# EAGLE design Mini AMplifier (EAGLE 7.6.0)
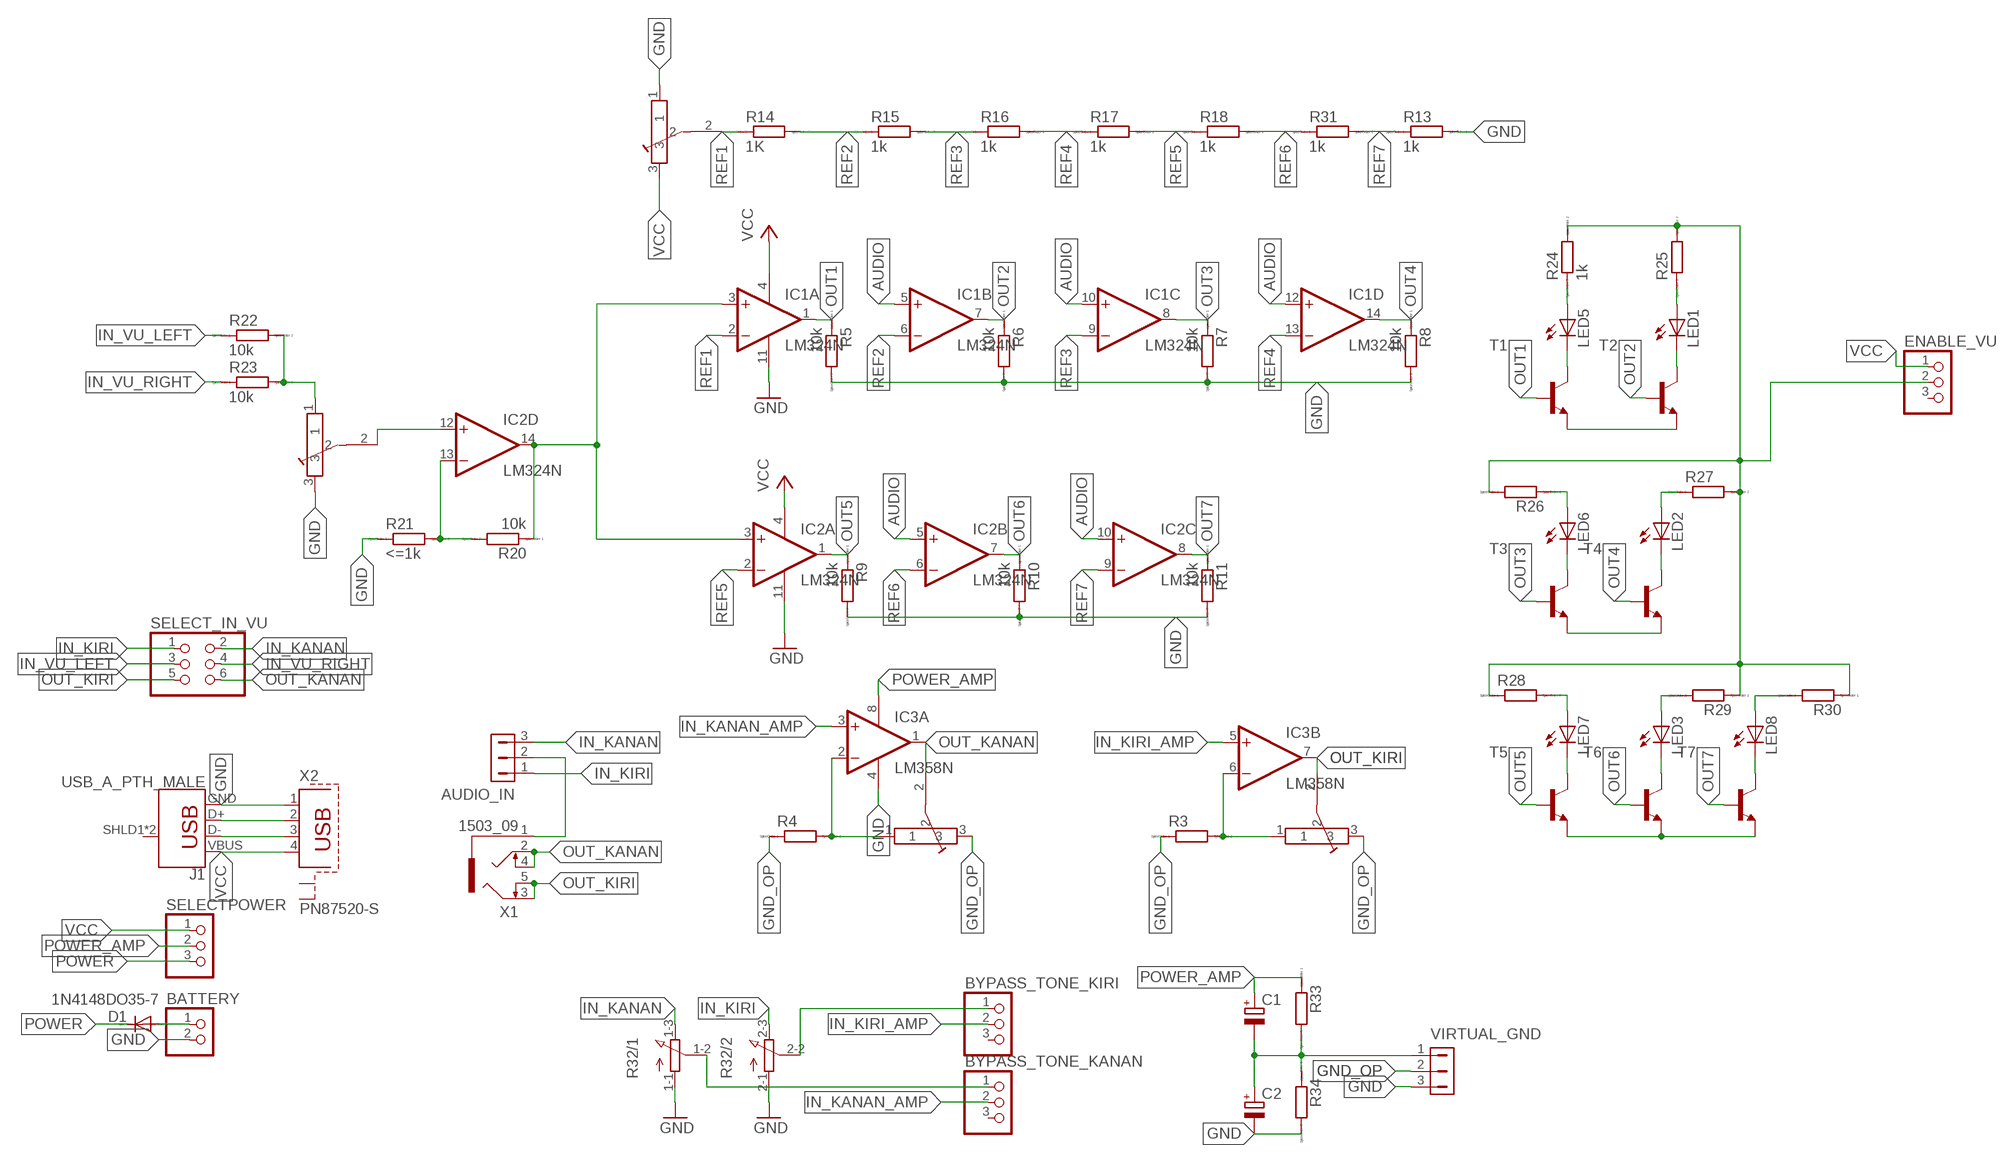
[diagram p0: schematic, sheet 1]

## Parts
AUDIO_IN  HDR-1X3  [SIP-100-3V]
BATTERY  PINHD-1X2  [1X02]
BYPASS_TONE_KANAN  PINHD-1X3  [1X03]
BYPASS_TONE_KIRI  PINHD-1X3  [1X03]
C1  CPOL-EUE2.5-6  [E2,5-6]
C2  CPOL-EUE2.5-6  [E2,5-6]
D1  1N4148DO35-7  [DO35-7]
ENABLE_VU  PINHD-1X3  [1X03]
IC1  LM324N  [DIL14]
IC2  LM324N  [DIL14]
IC3  LM358N  [DIL08]
J1  USB_A_PTH_MALE  [USB-A-H]
LED1  LED3MM  [LED3MM]
LED2  LED3MM  [LED3MM]
LED3  LED3MM  [LED3MM]
LED5  LED3MM  [LED3MM]
LED6  LED3MM  [LED3MM]
LED7  LED3MM  [LED3MM]
LED8  LED3MM  [LED3MM]
R3  R  [R0805]
R4  R  [R0805]
R5  10k  R0204/7  [0204/7]
R6  10k  R0204/7  [0204/7]
R7  10k  R0204/7  [0204/7]
R8  10k  R0204/7  [0204/7]
R9  10k  R0204/7  [0204/7]
R10  10k  R0204/7  [0204/7]
R11  10k  R0204/7  [0204/7]
R13  1k  R0204/7  [0204/7]
R14  1K  R0204/7  [0204/7]
R15  1k  R0204/7  [0204/7]
R16  1k  R0204/7  [0204/7]
R17  1k  R0204/7  [0204/7]
R18  1k  R0204/7  [0204/7]
R20  10k  R  [R0805]
R21  <=1k  R  [R0805]
R22  10k  R  [R0805]
R23  10k  R  [R0805]
R24  1k  R  [R0805]
R25  R  [R0805]
R26  R  [R0805]
R27  R  [R0805]
R28  R  [R0805]
R29  R  [R0805]
R30  R  [R0805]
R31  1k  R0204/7  [0204/7]
R32  3RP/1610G  [3RP/1610G]
R33  R0204/7  [0204/7]
R34  R0204/7  [0204/7]
SELECT_IN_VU  PINHD-2X3  [2X03]
SELECTPOWER  PINHD-1X3  [1X03]
T1  -NPN-TO92-EBC  [TO92-EBC]
T2  -NPN-TO92-EBC  [TO92-EBC]
T3  -NPN-TO92-EBC  [TO92-EBC]
T4  -NPN-TO92-EBC  [TO92-EBC]
T5  -NPN-TO92-EBC  [TO92-EBC]
T6  -NPN-TO92-EBC  [TO92-EBC]
T7  -NPN-TO92-EBC  [TO92-EBC]
U$1  TRIMPOT  [TRIMPOT]
U$2  TRIMPOT  [TRIMPOT]
U$3  TRIMPOT  [TRIMPOT]
U$4  TRIMPOT  [TRIMPOT]
VIRTUAL_GND  HDR-1X3  [SIP-100-3V]
X1  1503_09  [1503_09]
X2  PN87520-S  [PN87520-S]

## Nets
AUDIO: IC1.3(A:+IN) IC1.5(B:+IN) IC1.10(C:+IN) IC1.12(D:+IN) IC2.3(A:+IN) IC2.5(B:+IN) IC2.10(C:+IN) IC2.14(D:OUT) R20.1
GND: BATTERY.2 C2.- IC1.11(P:V-) IC2.11(P:V-) IC3.4(P:V-) J1.GND R5.2 R6.2 R7.2 R8.2 R9.2 R10.2 R11.2 R13.2 R21.1 R32.1-1(/1:A) R32.2-1(/2:A) R34.2 T1.E T2.E T3.E T4.E T5.E T6.E T7.E U$1.3 U$2.1 VIRTUAL_GND.3 X2.1
GND_OP: R3.1 R4.1 U$3.3 U$4.3 VIRTUAL_GND.2
IN_KANAN: AUDIO_IN.3 R32.1-3(/1:E) SELECT_IN_VU.2
IN_KANAN_AMP: BYPASS_TONE_KANAN.2 IC3.3(A:+IN)
IN_KIRI: AUDIO_IN.1 R32.2-3(/2:E) SELECT_IN_VU.1
IN_KIRI_AMP: BYPASS_TONE_KIRI.2 IC3.5(B:+IN)
IN_VU_LEFT: R22.1 SELECT_IN_VU.3
IN_VU_RIGHT: R23.1 SELECT_IN_VU.4
LAMPU: ENABLE_VU.2 R24.2 R25.2 R26.2 R27.2 R28.1 R29.1 R30.1
N$1: AUDIO_IN.2 X1.1
N$2: LED5.K(C) T1.C
N$3: IC3.6(B:-IN) R3.2 U$4.1
N$4: IC3.2(A:-IN) R4.2 U$3.1
N$5: LED1.K(C) T2.C
N$6: IC2.12(D:+IN) U$1.2
N$7: LED6.K(C) T3.C
N$8: LED2.K(C) T4.C
N$9: IC2.13(D:-IN) R20.2 R21.2
N$10: LED7.A R28.2
N$11: LED3.K(C) T6.C
N$12: LED7.K(C) T5.C
N$13: LED8.K(C) T7.C
N$14: R22.2 R23.2 U$1.1
N$15: LED3.A R29.2
N$16: LED8.A R30.2
N$17: LED6.A R26.1
N$18: LED2.A R27.1
N$19: LED5.A R24.1
N$20: LED1.A R25.1
N$21: BATTERY.1 D1.A
N$22: J1.D+ X2.2
N$23: J1.D- X2.3
N$24: C1.- C2.+ R33.2 R34.1 VIRTUAL_GND.1
N$26: BYPASS_TONE_KANAN.1 R32.1-2(/1:S)
N$27: BYPASS_TONE_KIRI.1 R32.2-2(/2:S)
OUT1: IC1.1(A:OUT) R5.1 T1.B
OUT2: IC1.7(B:OUT) R6.1 T2.B
OUT3: IC1.8(C:OUT) R7.1 T3.B
OUT4: IC1.14(D:OUT) R8.1 T4.B
OUT5: IC2.1(A:OUT) R9.1 T5.B
OUT6: IC2.7(B:OUT) R10.1 T6.B
OUT7: IC2.8(C:OUT) R11.1 T7.B
OUT_KANAN: IC3.1(A:OUT) SELECT_IN_VU.6 U$3.2 X1.2 X1.4
OUT_KIRI: IC3.7(B:OUT) SELECT_IN_VU.5 U$4.2 X1.3 X1.5
POWER: D1.C SELECTPOWER.3
POWER_AMP: C1.+ IC3.8(P:V+) R33.1 SELECTPOWER.2
REF1: IC1.2(A:-IN) R14.1 U$2.2
REF2: IC1.6(B:-IN) R14.2 R15.1
REF3: IC1.9(C:-IN) R15.2 R16.1
REF4: IC1.13(D:-IN) R16.2 R17.1
REF5: IC2.2(A:-IN) R17.2 R18.1
REF6: IC2.6(B:-IN) R18.2 R31.1
REF7: IC2.9(C:-IN) R13.1 R31.2
VCC: ENABLE_VU.1 IC1.4(P:V+) IC2.4(P:V+) J1.VBUS SELECTPOWER.1 U$2.3 X2.4
Unconnected: BYPASS_TONE_KANAN.3 BYPASS_TONE_KIRI.3 ENABLE_VU.3 J1.SHLD1(SHIELD) J1.SHLD2(SHIELD) X2.S1 X2.S2

## Library data of the parts
AUDIO_IN VIRTUAL_GND = con-hdrs40:HDR-1X3: HEADER CONNECTOR
BATTERY = pinhead:PINHD-1X2: PIN HEADER
BYPASS_TONE_KANAN BYPASS_TONE_KIRI ENABLE_VU SELECTPOWER = pinhead:PINHD-1X3: PIN HEADER
C1 C2 = rcl:CPOL-EU: POLARIZED CAPACITOR, European symbol
D1 = diode:1N4148: DIODE high speed (Philips)
IC1 IC2 = linear:LM324: OP AMP
IC3 = linear:LM358: OP AMP also LM158; LM258; LM2904 Source: http://cache.national.com/ds/LM/LM158.pdf
J1 = SparkFun-Connectors:USB_A: USB-A Connector Male and female variants, as well as PTH and SMT variants SparkFun Products: SparkFun XBee Explorer Dongle <https://www.sparkfun.com/products/11697> PTH Male SparkFun MicroView-USB Programmer <https://www.sparkfun.com/products/12924> SMT Male SparkFun USB Type A Female Breakout <https://www.sparkfun.com/products/12700> SMT Female; PROD_ID: CONN-08367; SF_ID: PRT-00437
LED1-LED3 LED5-LED8 = led:LED: LED OSRAM: - CHIPLED LG R971, LG N971, LY N971, LG Q971, LY Q971, LO R971, LY R971 LH N974, LH R974 LS Q976, LO Q976, LY Q976 LO Q996 - Hyper CHIPLED LW Q18S LB Q993, LB Q99A, LB R99A - SideLED LS A670, LO A670, LY A670, LG A670, LP A670 LB A673, LV A673, LT A673, LW A673 LH A674 LY A675 LS A676, LA A676, LO A676, LY A676, LW A676 LS A679, LY A679, LG A679 - Hyper Micro SIDELED® LS Y876, LA Y876, LO Y876, LY Y876 LT Y87S - SmartLED LW L88C, LW L88S LB L89C, LB L89S, LG L890 LS L89K, LO L89K, LY L89K LS L896, LA L896, LO L896, LY L896 - TOPLED LS T670, LO T670, LY T670, LG T670, LP T670 LSG T670, LSP T670, LSY T670, LOP T670, LYG T670 LG T671, LOG T671, LSG T671 LB T673, LV T673, LT T673, LW T673 LH T674 LS T676, LA T676, LO T676, LY T676, LB T676, LH T676, LSB T676, LW T676 LB T67C, LV T67C, LT T67C, LS T67K, LO T67K, LY T67K, LW E67C LS E67B, LA E67B, LO E67B, LY E67B, LB E67C, LV E67C, LT E67C LW T67C LS T679, LY T679, LG T679 LS T770, LO T770, LY T770, LG T770, LP T770 LB T773, LV T773, LT T773, LW T773 LH T774 LS E675, LA E675, LY E675, LS T675 LS T776, LA T776, LO T776, LY T776, LB T776 LHGB T686 LT T68C, LB T68C - Hyper Mini TOPLED® LB M676 - Mini TOPLED Santana® LG M470 LS M47K, LO M47K, LY M47K Source: http://www.osram.convergy.de LUXEON: - LUMILED® LXK2-PW12-R00, LXK2-PW12-S00, LXK2-PW14-U00, LXK2-PW14-V00 LXK2-PM12-R00, LXK2-PM12-S00, LXK2-PM14-U00 LXK2-PE12-Q00, LXK2-PE12-R00, LXK2-PE12-S00, LXK2-PE14-T00, LXK2-PE14-U00 LXK2-PB12-K00, LXK2-PB12-L00, LXK2-PB12-M00, LXK2-PB14-N00, LXK2-PB14-P00, LXK2-PB14-Q00 LXK2-PR12-L00, LXK2-PR12-M00, LXK2-PR14-Q00, LXK2-PR14-R00 LXK2-PD12-Q00, LXK2-PD12-R00, LXK2-PD12-S00 LXK2-PH12-R00, LXK2-PH12-S00 LXK2-PL12-P00, LXK2-PL12-Q00, LXK2-PL12-R00 Source: www.luxeon.com KINGBRIGHT: KA-3528ASYC Source: www.kingbright.com
R3-R11 R13-R18 R20-R31 R33 R34 = eagle-ltspice:R: RESISTOR, European symbol; SPICEMODEL: NONE; SPICEPREFIX: R
R32 = pot:3RP/1610G: 16mm Potentiometer two level Source: http://www.alphapotentiometers.net/html/16mm_pot_2.html
SELECT_IN_VU = pinhead:PINHD-2X3: PIN HEADER
T1-T7 = transistor:*-NPN-: NPN Transistror BF959 corrected 2008.03.06
U$1-U$4 = trimpot:TRIMPOT
X1 = con-lumberg:1503_09: Jack connectors according to JISC 6560, 3.5 mm Klinkeneinbaukupplung nach JISC 6560, 3,5 mm, 3-polig/ stereo, abgewinkelte Ausführung, mit 2 Öffnern und Lötaugen, für Leiterplatten Rückseitenmontage Source: http://www.lumberg.com/Produkte/PDFs/1503_09.pdf; OC_FARNELL: 1243244; OC_NEWARK: unknown
X2 = con-berg:PN87520-S; OC_FARNELL: unknown; OC_NEWARK: unknown

## Board
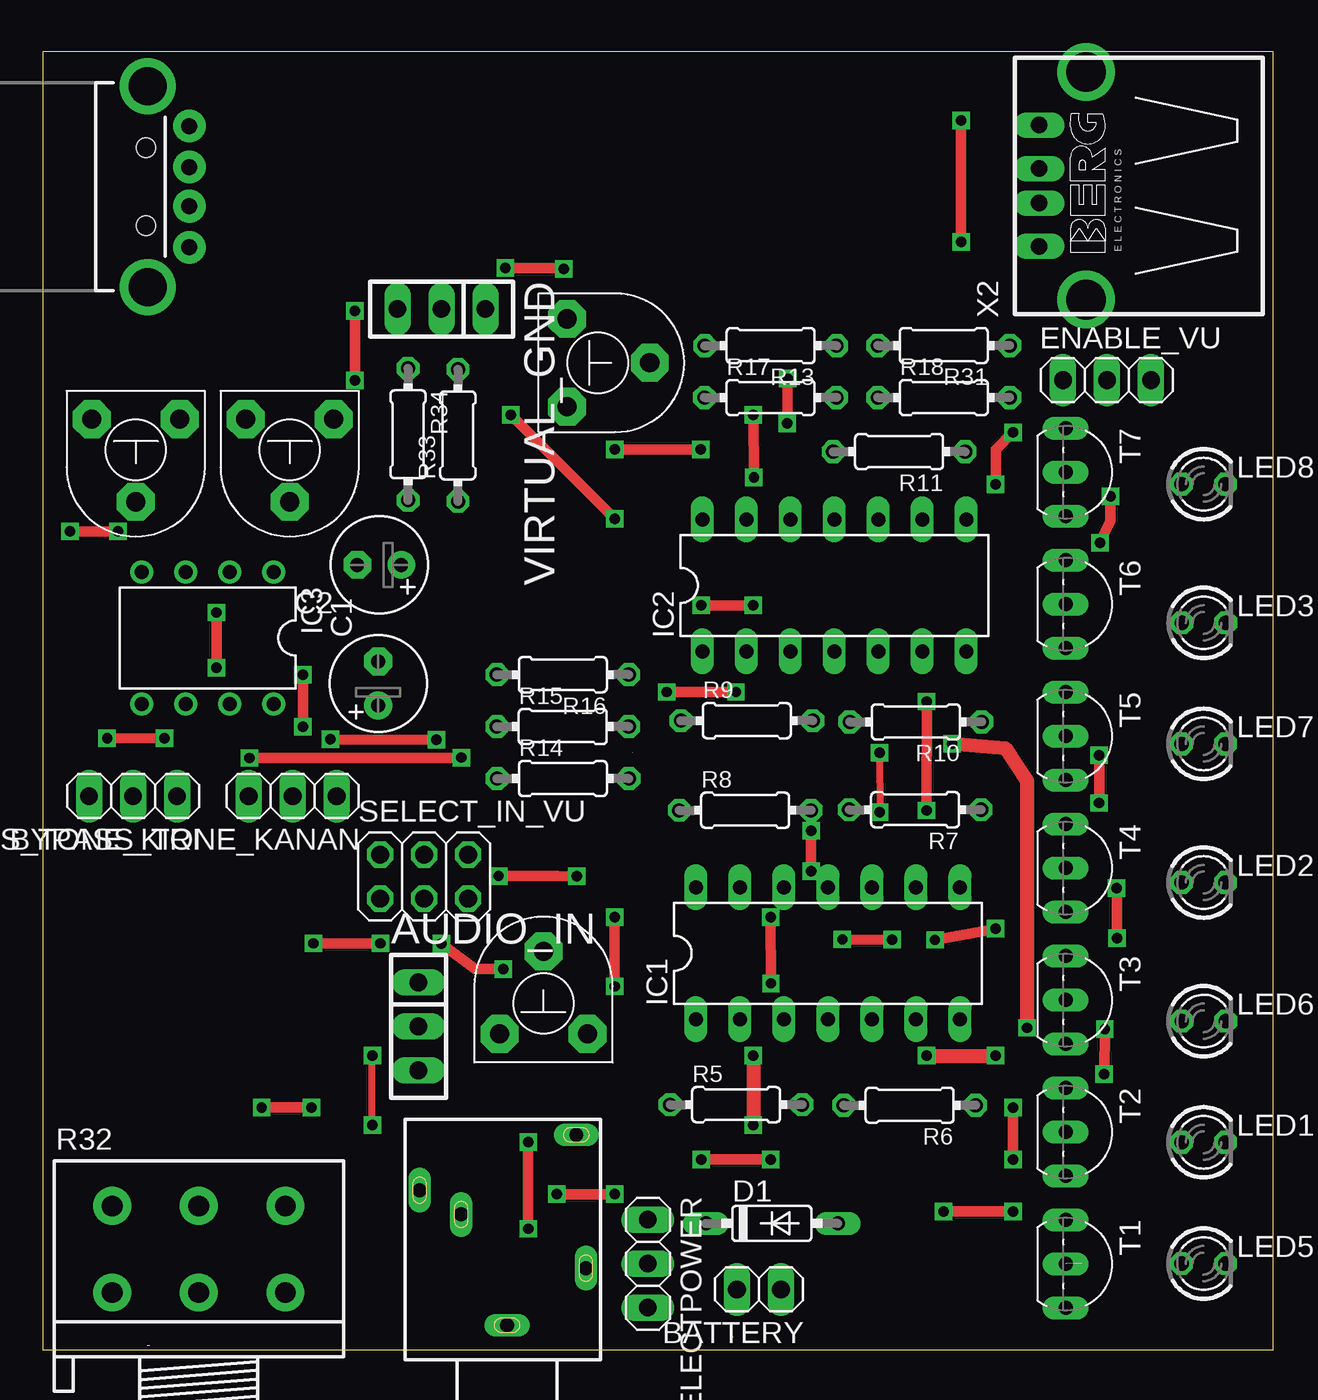
[diagram p1: board, top side]
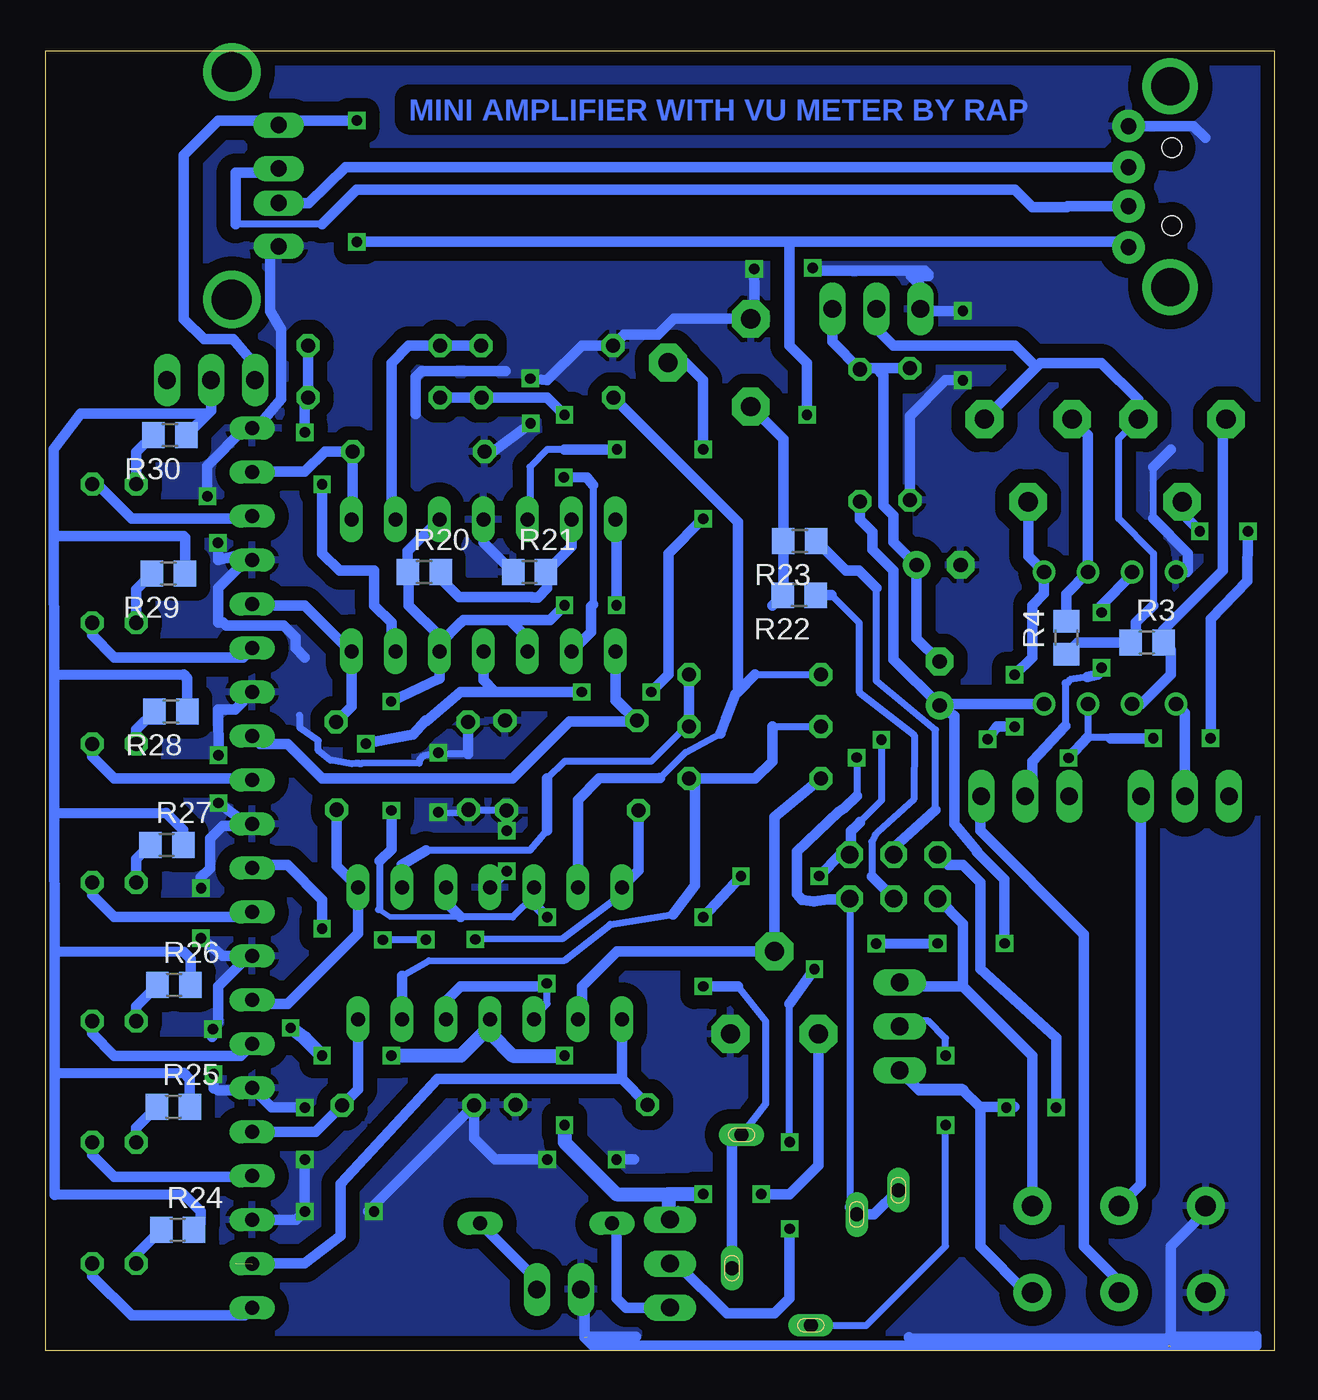
[diagram p2: board, bottom side, seen from below]

Size 71 x 75 mm. Coordinates in mm from the lower left corner, seen from the top.
Outline: 0,0 0,75 71,75 71,0 0,0
Copper layers (1*16): Top 0.035mm / dielectric 1.5mm / Bottom 0.035mm
Design rules "default *": minimum track width 10mil, minimum drill 24mil, track to track 8mil, track to pad 8mil, pad to pad 8mil, via to via 8mil, smd to smd 8mil, copper to edge 20mil, drill to drill 8mil, minimum pad ring 10mil, minimum via ring 8mil, stop-mask expansion 4mil, vias tented up to drill 0mil, thermal gap 10mil

### Footprints (pad centres in the part's own frame; a part is rotated, then mirrored left to right if it is on the bottom)
SIP-100-3V = drill 1.016 long: 1 -2.54,0; 2 0,0; 3 2.54,0
1X02 = drill 1.016 long: 1 -1.27,0; 2 1.27,0
1X03 = drill 1.016 long: 1 -2.54,0; 2 0,0; 3 2.54,0
E2,5-6 = drill 0.813 pad 1.6: + -1.27,0 | drill 0.813 pad 1.6 octagon: - 1.27,0
DO35-7 = drill 0.813 long: A 3.81,0; C -3.81,0
DIL14 = drill 0.813 long: 1 -7.62,-3.81; 2 -5.08,-3.81; 3 -2.54,-3.81; 4 0,-3.81; 5 2.54,-3.81; 6 5.08,-3.81; 7 7.62,-3.81; 8 7.62,3.81; 9 5.08,3.81; 10 2.54,3.81; 11 0,3.81; 12 -2.54,3.81; 13 -5.08,3.81; 14 -7.62,3.81
DIL08 = drill 0.813 pad 1.27: 1 -3.81,-3.81; 2 -1.27,-3.81; 3 1.27,-3.81; 4 3.81,-3.81; 5 3.81,3.81; 6 1.27,3.81; 7 -1.27,3.81; 8 -3.81,3.81
USB-A-H = drill 0.914 pad 1.88: D+ 2.4,1.127; D- 2.4,-1.127; GND 2.4,3.5; VBUS 2.4,-3.5 | drill 2.2: SHLD1 0,-5.8; SHLD2 0,5.8 | hole 1.1: -0.1,2.25; -0.1,-2.25
LED3MM = drill 0.813 octagon: A -1.27,0; K 1.27,0
R0805 = smd 1.3 x 1.5: 1 -0.95,0; 2 0.95,0
0204/7 = drill 0.813 octagon: 1 -3.81,0; 2 3.81,0
3RP/1610G = drill 1.2 pad 2.184: 1-1 -5,0; 1-2 0,0; 1-3 5,0; 2-1 -5,5; 2-2 0,5; 2-3 5,5
2X03 = drill 1.016 octagon: 1 -2.54,-1.27; 2 -2.54,1.27; 3 0,-1.27; 4 0,1.27; 5 2.54,-1.27; 6 2.54,1.27
TO92-EBC = drill 0.813 long: B 0,-1.27; C 2.54,-1.27; E -2.54,-1.27
TRIMPOT = drill 1.1 pad 2.184 octagon: 1 -2.538,1.271; 2 0,-3.5; 3 2.536,1.271
1503_09 = drill 0.8 pad 1.2 long: 1 0,-2.1; 2 -4.55,-5.4; 3 5.05,-9.9; 4 -4,-13.1; 5 2.65,-8.5
PN87520-S = drill 0.95 long: 1 -3.5,2.71; 2 -1,2.71; 3 1,2.71; 4 3.5,2.71 | drill 2.3 pad 2.9: S1 -6.57,0; S2 6.57,0

### Placement (x,y rotation side)
AUDIO_IN  21.66,18.69 270 top
BATTERY  41.33,3.5 180 top
BYPASS_TONE_KANAN  14.4,31.99 180 top
BYPASS_TONE_KIRI  5.18,31.99 180 top
C1  19.34,38.49 90 top
C2  19.4,45.34 180 top
D1  42.07,7.31 0 top
ENABLE_VU  61.42,56.01 0 top
IC1  45.31,22.91 0 top
IC2  45.68,44.15 0 top
IC3  9.5,41.12 180 top
J1  6.03,67.18 0 top
LED1  67,12 0 top
LED2  67,27 0 top
LED3  67.01,41.99 0 top
LED5  67,4.99 0 top
LED6  67,18.99 0 top
LED7  67,35 0 top
LED8  67,50 0 top
R3  7.37,40.85 0 bottom
R4  12.03,41.14 90 bottom
R5  40.01,14.17 0 top
R6  50.03,14.14 180 top
R7  50.35,31.2 180 top
R8  40.53,31.17 0 top
R9  40.62,36.34 0 top
R10  50.39,36.27 180 top
R11  49.42,51.88 180 top
R13  42,58 180 top
R14  30,33 0 top
R15  30,36 0 top
R16  30,39 180 top
R17  41.99,55 0 top
R18  52,55 0 top
R20  49.1,44.93 0 bottom
R21  43.02,44.93 0 bottom
R22  27.45,43.58 180 bottom
R23  27.42,46.71 180 bottom
R24  63.34,6.93 0 bottom
R25  63.58,14.04 0 bottom
R26  63.55,21.09 0 bottom
R27  63.97,29.17 0 bottom
R28  63.73,36.88 180 bottom
R29  63.87,44.83 180 bottom
R30  63.79,52.83 180 bottom
R31  52,58.01 180 top
R32  8.98,3.32 0 top
R33  23.94,52.82 90 top
R34  21.06,52.88 270 top
SELECT_IN_VU  21.99,27.34 0 top
SELECTPOWER  34.91,4.99 270 top
T1  60.31,4.97 270 top
T2  60.31,12.59 270 top
T3  60.31,20.21 270 top
T4  60.31,27.83 270 top
T5  60.31,35.45 270 top
T6  60.31,43.07 270 top
T7  60.31,50.69 270 top
U$1  31.52,57.01 90 top
U$2  28.88,19.52 180 top
U$3  14.23,52.48 0 top
U$4  5.34,52.48 0 top
VIRTUAL_GND  22.99,60.11 180 top
X1  26.78,-0.67 180 top
X2  60.22,67.23 90 top

### Tracks (layer width: path | path; a pad name or v marks a point on that pad's centre or on a via)
AUDIO  (via drill 0.6)
  Top 0.61: v41,43 v38,43 | v42.02,21.17 v42,25 | v51.02,37.45 v51,31.16
  Bottom 0.305: 51.74,25.42 51.68,25.42 51.08,25.01 47.32,25.01 47.07,25.07
  Bottom 0.406: 42.77,26.23 44,25 47,25 | 51.67,28.25 51.67,25.49 51.74,25.42 | IC1.3 42.77,19.23 42,20 42,21.15 v42.02,21.17
  Bottom 0.61: 42.77,26.23 IC1.12 42.77,25.77 v42,25 | 47,25 47.07,25.07 48,26 48,26.57 IC1.10 | IC1.5 47.85,20.15 47,21 42,21 v42.02,21.17 | IC2.10 50.05,46.13 R20.1 50,44.88 50,43 48.22,41.22 IC2.5 | IC2.5 48.22,40.78 47,42 46.99,42 46.83,42.16 44.16,42.16 | 44.16,42.16 44,42 44,41.98 43.38,41.36 43.38,40.58 IC2.3 | 44.16,42.16 41.84,42.16 v41,43 | v38,43 38,47.9 IC2.14 | IC2.5 48.22,38.78 v51.02,37.45 | v51,31.16 51,28.91 51.67,28.25
GND  (via drill 0.6)  (2 unrouted)
  Top 0.406: v48.3,34.49 v48.3,31.05
  Top 0.61: v42,11 v38,11 | v44.34,27.66 v44.34,29.99 | v18,56 v18,60 | v52,8 v56,8 | v56,14 v56,11 | v42.96,53.51 v42.98,56.1 | v61.63,49.31 61.63,47.87 v61.02,46.61 | v60.98,31.59 v60.98,34.34 | v26.68,62.49 29.51,62.49 v30.05,62.44 | v62,23.79 v61.99,26.67 | v61.3,18.52 v61.27,15.94
  Bottom 0.406: 7,48 7,51 | 56.32,36.66 56.28,36.63 56.28,35.93 55.23,35.19 55.23,34.62 54.52,34.07 53.3,33.86 53.04,33.88 52.89,33.88 52.85,33.85 52.73,33.86 49.4,33.89 49.37,34.1 49.35,34.1 49.16,34.29 v48.3,34.49 48.2,34.42 46.58,34.42 | v48.3,31.05 46.74,31 R7.2 44.37,31.2 R8.2
  Bottom 0.6: J1.GND 4.68,70.68 4,70
  Bottom 0.61: v42,11 45,11 46.22,12.22 R6.2 52.35,8 v52,8 | v38,11 37,11 | IC1.11 v44.34,27.66 | v44.34,29.99 R8.2 | R21.1 45.68,46.64 IC2.11 | R34.2 21.06,53.94 19,56 v18,56 | v18,60 20.34,60 VIRTUAL_GND.3 20.45,61.45 21,62 20,62 20,62.13 20.19,62.32 26.52,62.32 v26.68,62.49 | T1.E 56.49,7.51 v56,8 v56,11 | v56,14 57.91,14 T2.E 59.17,15 61,15 61.27,15.1 v61.27,15.94 | IC3.4 5.07,44.93 5,45 5,46 7,48 | 7,51 6,52 | R32.2-1 3.98,8.02 6,6 6,0.55 6.01,0.54 6.01,0.25 | 6.01,0.25 39.36,0.25 39.84,0.73 39.84,3.28 BATTERY.2 | 21.11,0.72 21.03,0.65 6.29,0.65 6.29,0.53 6.01,0.25 | 36.88,0.76 39.7,0.76 | 6.11,0.77 1.08,0.77 1.04,0.8 1.04,0.26 6.14,0.26 6.16,0.28 | R11.2 45.12,51.88 v42.96,53.51 | v42.98,56.1 42,56 40,58 R13.2 37.56,58.63 35.59,58.63 34.67,59.55 U$1.3 30,59.8 v30.05,62.44 | v61.63,49.31 61.64,49.08 61.64,51.05 59.47,53.23 T7.E 58.77,53.23 57.38,54.91 57.38,58.91 58,60 58,63.24 X2.1 | v61.02,46.61 61.02,45.61 59.43,46 T6.E 59.39,45.61 61,44 61,42 60.72,42 60.55,41.83 57.21,41.83 56.53,41.14 56.53,40.53 56,40 | v60.98,31.59 59.37,30.37 T4.E 59.14,30.27 60.73,30.27 61.47,29.53 61.47,27.82 62,27.28 v61.99,26.67 | v60.98,34.34 61,37 60.03,37 T5.E | v62,23.79 60.75,22.75 T3.E 59.25,22.75 61,21 61,18.95 61.35,18.6 61.35,18.08 v61.3,18.52 | R10.2 46.58,34.42 | 49.6,54.06 49.6,56.18 49.24,56.54 44.39,56.54
  pour Bottom (isolate 0.813): 0,0 71,0 71,75 0,75
GND_OP
  Bottom 0.406: 7,43 7,46 9,48 9,52.63 U$4.3
  Bottom 0.61: U$4.3 7.88,54.88 10,57 13.52,57 13.76,56.76 | 13.76,56.76 U$3.3 | 7,43 8,42 8,41.17 R3.1 11.37,40.85 R4.1 | VIRTUAL_GND.2 22.99,58.99 22,58 15,58 13.76,56.76
IN_KANAN  (via drill 0.6)
  Top 0.61: v15.49,14 v12.61,14
  Bottom 0.61: R32.1-3 14.32,3.32 17,6 17,14 18,15 20.51,15 AUDIO_IN.3 | AUDIO_IN.3 21.66,16.13 20.52,14.99 18.02,14.99 17.98,15.03 | AUDIO_IN.3 20.58,15.07 18.1,15.07 18.01,14.99 17.98,14.99 17.03,14.03 15.03,14.03 v15.49,14 | v12.61,14 12.61,18.04 17,22 17,27 18,28 18.84,28 SELECT_IN_VU.2
IN_KANAN_AMP  (via drill 0.6)
  Top 0.61: v10,42.59 v10,39.39
  Bottom 0.406: 10.8,38.86 11.81,38.71 12,38.5 12.1,38.53 12.09,38.46 12.09,36.03
  Bottom 0.61: IC3.3 8.23,44.77 10,43 v10,42.59 | v10,39.39 10.21,39 10.8,38.86 | 12.09,36.03 14,34 14,32.39 BYPASS_TONE_KANAN.2
IN_KIRI
  Bottom 0.61: R32.2-3 13.98,16.98 18,21 | 18,21 21.43,21 AUDIO_IN.1 | 18,21 18,24.62 SELECT_IN_VU.1
IN_KIRI_AMP
  Bottom 0.61: BYPASS_TONE_KIRI.2 5.18,36.8 IC3.5
IN_VU_LEFT
  Bottom 0.406: 25.58,43.58 24,42 24,38 20.8,35.51 20.83,31.8 22.91,29.91 23.06,29.75 23.26,29.36 23.26,27.34
  Bottom 0.61: R22.1 25.58,43.58 | 23.26,27.34 SELECT_IN_VU.3
IN_VU_RIGHT
  Bottom 0.406: 19.59,31.17 19.58,35.81 22.99,38.64 23,44
  Bottom 0.61: SELECT_IN_VU.4 21.99,29.01 19.59,31.17 | 23,44 24,45 24.75,45 R23.1
LAMPU
  Bottom 0.6: ENABLE_VU.2 61.42,54.25 R30.1 62.83,52.83 61.59,54.06 68.94,54.06 70.5,52.04 70.5,46.99 | 70.5,46.99 70.47,38.98 | 70.47,38.98 70.47,30.98 | 70.47,30.98 70.43,23.02 | 70.43,23.02 70.43,15.96 | 70.43,15.96 70.43,8.96 63,9 62,8 62,7.32 R24.2 | R25.2 62.63,15.63 63,16 70.43,15.96 | R26.2 62.6,22.6 63,23 70.43,23.02 | R27.2 63.02,30.02 64,31 70.47,30.98 | R28.1 62.78,38.78 63,39 70.47,38.98 | R29.1 62.92,46.92 63,47 70.5,46.99
N$1  (via drill 0.6)
  Top 0.406: v19,13 v19,17
  Bottom 0.406: X1.1 23.57,1.43 19,6 v19,13 | v19,17 19,18 20,19 21.35,19 AUDIO_IN.2
N$2
  Bottom 0.6: LED5.K 68.27,4.27 66,2 59.47,2 T1.C
N$3
  Bottom 0.61: IC3.6 7.69,37.31 6,39 6,40.43 R3.2 6.42,41.58 3,45 3,53.55 U$4.1
N$4
  Bottom 0.61: R4.2 12.03,43.67 IC3.2 10.77,52.83 U$3.1
N$5
  Bottom 0.6: LED1.K 68.27,11.27 67,10 59.09,10 T2.C
N$6  (via drill 0.6)
  Top 0.61: v37.97,52 v33,52
  Bottom 0.406: 41,52 42,52 43,51 43,48.1 IC2.12
  Bottom 0.61: 41,52 v37.97,52 | v33,52 33,56 34.01,57.01 U$1.2
N$7
  Bottom 0.6: LED6.K 68.27,18.27 67,17 59.71,17 T3.C
N$8
  Bottom 0.6: LED2.K 68.27,26.27 67,25 59.33,25 T4.C
N$9
  Bottom 0.61: IC2.13 40.6,46.4 R21.2 42,44.86 42,44 42.54,43.46 42.89,43.46 42.91,43.48 47.09,43.48 48.15,44.54 R20.2
N$10
  Bottom 0.6: LED7.A 65.73,35.83 R28.2
N$11
  Bottom 0.6: LED3.K 68.28,41.27 67,40 59.57,40 T6.C
N$12
  Bottom 0.6: LED7.K 68.27,34.27 67,33 59.13,33 T5.C
N$13
  Bottom 0.6: LED8.K 68,50 66,48 59.19,48 T7.C
N$14
  Bottom 0.61: R22.2 28.98,43 29,43 28.37,43.63 R23.2 28.37,52.59 U$1.1
N$15
  Bottom 0.6: LED3.A 65.73,43.91 R29.2
N$16
  Bottom 0.6: LED8.A 65.73,51.84 R30.2
N$17
  Bottom 0.6: LED6.A 65.73,19.86 R26.1
N$18
  Bottom 0.6: LED2.A 65.73,28.36 R27.1
N$19
  Bottom 0.6: LED5.A 65.73,5.49 R24.1
N$20
  Bottom 0.6: LED1.A 65.73,12.84 R25.1
N$21
  Bottom 0.61: BATTERY.1 42.59,4.03 D1.A
N$22
  Bottom 0.6: X2.2 55.77,66.23 53.65,68.29 8.39,68.29 J1.D+
N$23
  Bottom 0.406: 55,65 60,65
  Bottom 0.6: J1.D- 11.95,66.05 12,66 14,66 15,67 53,67 55,65 | 60,65 60,68 57.74,68 X2.3
N$24
  Bottom 0.61: R34.1 23,56.69 | 23,56.69 23.88,56.69 R33.2 25.53,58.22 VIRTUAL_GND.1 | C1.- 20.67,41.09 C2.+ 22,46.67 22,48.18 22.58,48.76 22.58,56.27 23,56.69
N$26
  Bottom 0.61: R32.1-2 8.98,3.98 11,6 11,24 17,30 17,32.05 | 17,33 17,32.05 | 17,32.05 BYPASS_TONE_KANAN.1
N$27
  Bottom 0.61: BYPASS_TONE_KIRI.1 7.72,9.58 R32.2-2
OUT1  (1 unrouted)
  Bottom 0.61: R5.1 37.69,15.66 | 37.69,15.66 IC1.1 | 37.69,15.66 48.34,15.66 53.94,9.61 53.94,6.61 56,5 60,5
OUT2
  Bottom 0.61: T2.B 55.38,12.59 R6.1 52.93,15.04 IC1.7
OUT3
  Bottom 0.61: R7.1 54.16,27.95 IC1.8 52.93,24.07 57,20 58.83,20 T3.B
OUT4  (via drill 0.6)
  Top 0.61: v46.14,23.71 v49.01,23.69 | v51.49,23.68 v55,24.33
  Bottom 0.406: 37.69,26.31 41.12,23.75 v46.14,23.71 | v49.01,23.69 v51.49,23.68
  Bottom 0.61: R8.1 36.72,27.69 IC1.14 37.69,26.31 | v55,24.33 55,26 57,28 58.87,28 T4.B
OUT5
  Bottom 0.61: R9.1 38.06,37.59 | 38.06,37.59 IC2.1 | 38.06,37.59 38.06,37.52 36.83,36.29 40.71,36.29 44,33 55,33 57,35 58.59,35 T5.B
OUT6
  Bottom 0.61: R10.1 53.3,37.17 IC2.7 53.34,40.34 56,43 58.97,43 T6.B
OUT7
  Bottom 0.61: IC2.8 53.23,48.03 R11.1 54.84,51.88 56,50.72 59.01,50.72 T7.B
OUT_KANAN  (via drill 0.6)
  Top 0.61: v15,39 v15,36 | v16.57,35.26 v22.7,35.24 | v26.29,27.38 29.62,27.38 v30.81,27.36 | v33,24.99 v33,21
  Bottom 0.406: v22.7,35.24 22.7,31.74 23.94,30.49 | 31,21 29.39,19 29.39,14.21 X1.4
  Bottom 0.61: X1.2 31.33,11.88 X1.4 | U$3.2 14.23,45.85 IC3.1 13.31,43.69 14,43 14,40 v15,39 | v15,36 16.04,36 v16.57,35.26 | 23.94,30.49 23.94,30.46 24.34,30.07 24.37,30.07 24.45,29.98 24.45,28.69 SELECT_IN_VU.6 25.06,28.61 v26.29,27.38 | v30.81,27.36 v33,24.99 | v33,21 31,21
OUT_KIRI  (via drill 0.6)
  Top 0.61: v4.32,47.27 v1.54,47.27 | v3.69,35.34 v7,35.32 | v11.9,34.19 23.31,34.18 24.12,34.18 24.17,34.13 24.34,34.13 v24.13,34.22
  Bottom 0.406: SELECT_IN_VU.5 24.53,8.23 | v24.13,34.22 24.13,32.01 | 9.46,35.31 9.54,35.39 10.77,35.39 IC3.7
  Bottom 0.61: X1.3 23.13,7.83 X1.5 24.53,8.23 | U$4.2 5.34,48.34 v4.32,47.27 | v1.54,47.27 1.56,44.42 3.69,42.21 v3.69,35.34 | v7,35.32 9.46,35.31 | 10.77,35.39 v11.9,34.19 | 24.13,32.01 24.85,31.3 25.18,31.08 27.58,28.78 27.58,26.35 27.28,25.98 26.6,25.9 25.75,26.03 24.57,26.03 SELECT_IN_VU.5
POWER
  Bottom 0.61: SELECTPOWER.3 37.45,2.45 38,3 38,7.05 D1.C
POWER_AMP  (via drill 0.6)
  Top 0.61: v28,7 v28,12 | v26.57,22 24.92,22 v23,23.46 | v19.46,23.48 v15.6,23.48
  Bottom 0.406: v28,12 28,20
  Bottom 0.61: IC3.8 19.25,37.31 C1.+ | SELECTPOWER.2 34.5,4.99 31.62,2.12 28.88,2.12 28,3 v28,7 | 28,20 v26.57,22 | v23,23.46 v19.46,23.48 | v15.6,23.48 15.6,27.17 17.2,28.77 17.2,28.82 18.5,30.37 18.5,36.62 C1.+ | R33.1 23.94,47.96 23.23,47.25 23.23,46.23 22,45 22,39.88 C1.+
REF1
  Bottom 0.61: IC1.2 40,19.33 40,21 37.98,23.02 U$2.2 28.88,30.78 R14.1
REF2
  Bottom 0.406: 50.39,21.61 48.84,22.48 40.99,22.51 38.35,24.59 34.72,25.15 | 29,36 R15.1
  Bottom 0.61: IC1.6 50.39,21.61 | 34.72,25.15 33.48,26.83 33.48,32.96 R14.2 32.81,33 30,33 29,34 29,36
REF3
  Bottom 0.406: 34,36 36,34 41,34 42,33 | 42,30 42.98,28.85 48.98,28.85
  Bottom 0.61: R16.1 R15.2 34,36 | 42,33 42,30 | 48.98,28.85 50.41,28 IC1.9
REF4  (1 unrouted)
  Bottom 0.406: 35.48,33.03 34.02,34.5 | 34.01,34.52 32,35.61 | 30,39 R16.2 | R16.2
  Bottom 0.61: IC1.13 40.23,31.77 39,33 35.48,33.03 | 32,35.61 31.67,36.46 31.13,37.87 31,38 | 31,38 30,39 | R17.1 31,47.82 31,38
REF5  (via drill 0.6)
  Top 0.61: v41,54.01 v41.04,50.4
  Bottom 0.406: 39.36,49.94 39.36,43.04
  Bottom 0.61: R18.1 R17.2 42,55 v41,54 v41,54.01 | v41.04,50.4 39.72,50.38 39.36,49.94 | 39.36,43.04 39.48,42.93 39.48,41.46 IC2.2
REF6  (via drill 0.6)
  Top 0.61: v56,53 55,52 v55,50
  Bottom 0.61: R31.1 R18.2 56,54.81 v56,53 | v55,50 55,46 54,45 52,45 52,43 51,42 51,40.58 IC2.6
REF7
  Bottom 0.61: R13.1 R31.2 49.99,58.01 51,57 51,48.2 IC2.9
VCC  (via drill 0.6)
  Top 0.61: v29.65,9 v33,9 | v40,38 v36,38 | v33,48 v27,54 | v53,64 v53,71
  Top 0.813: v52.48,35.02 55.54,34.76 56.82,32.84 56.82,31.61 v56.82,18.61 | v51,17 v55,17 | v41,17 v41,13
  Bottom 0.6: X2.4 57.78,71 61,71 63,69 63,59.54 61.8,58.37 60.14,58.37 58.88,56.88 ENABLE_VU.1
  Bottom 0.61: U$2.3 26.34,10.66 28,9 v29.65,9 | 34.44,8 SELECTPOWER.1 | IC2.4 45.68,38.68 45,38 | 45,38 v40,38 | v36,38 35,39 35,46 v33,48 | v27,54 27,57 28,58 28,64 | 28,64 8.75,64 J1.VBUS | ENABLE_VU.1 58.88,57.12 | 45,38 47,38 48.97,36.31 49.01,36.34 49.74,35.54 51.92,35.15 v52.48,35.02 | 28,64 v53,64 | v53,71 57.24,71 X2.4
  Bottom 0.813: IC1.4 45.31,18.69 | 45.31,18.69 47,17 v51,17 | v55,17 56,18 v56.82,18.61 | 45.31,18.69 45.31,18.31 44,17 v41,17 | v41,13 41,12 38,9 35,9 | 35,9 35,7.62 SELECTPOWER.1 | v33,9 35,9

### Text on the board
Bottom: MINI AMPLIFIER WITH VU METER BY RAP